# EAGLE schematic Laptimer (EAGLE 6.3)
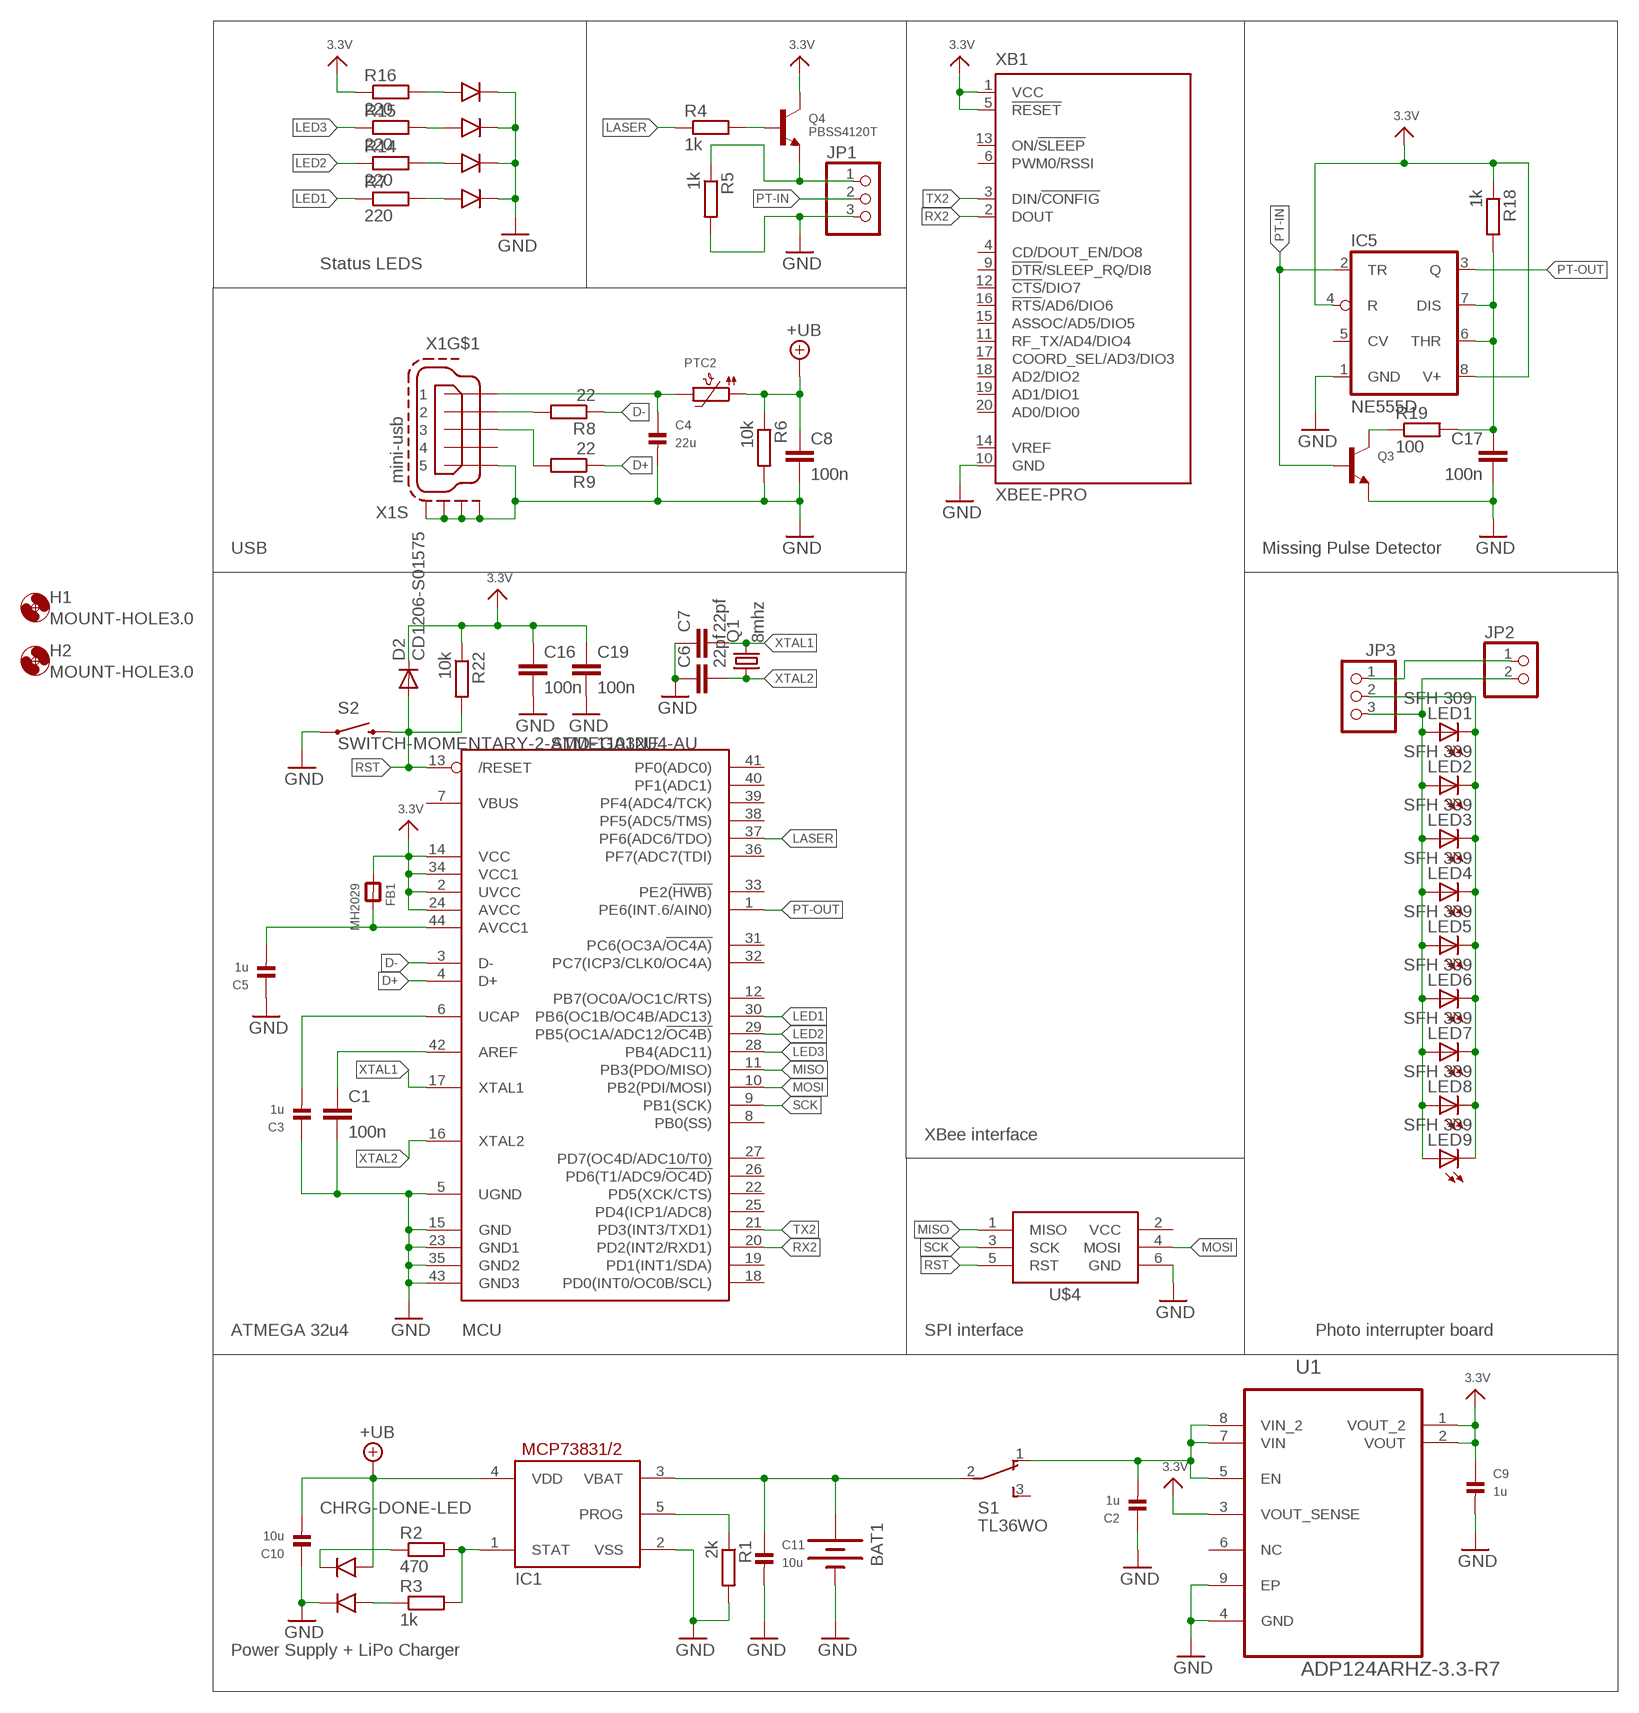
[diagram p0: schematic, sheet 1]

## Parts
BAT1  BATTERY18650  [BATTERY_18650-HOLDER]
C1  100n  C-EUC0603K  [C0603K]
C2  1u  CAP_CERAMIC_0805MP  [_0805MP]
C3  1u  CAP_CERAMIC_0805MP  [_0805MP]
C4  22u  CAP_CERAMIC_0805MP  [_0805MP]
C5  1u  CAP_CERAMIC_0805MP  [_0805MP]
C6  22pf  C-EUC0603K  [C0603K]
C7  22pf  C-EUC0603K  [C0603K]
C8  100n  C-EUC0603K  [C0603K]
C9  1u  CAP_CERAMIC_0805MP  [_0805MP]
C10  10u  CAP_CERAMIC_0805MP  [_0805MP]
C11  10u  CAP_CERAMIC_0805MP  [_0805MP]
C16  100n  C-EUC0603K  [C0603K]
C17  100n  C-EUC0603K  [C0603K]
C19  100n  C-EUC0603K  [C0603K]
D2  CD1206-S01575  DIODE-MINIMELF  [MINIMELF]
FB1  MH2029  FERRITE_0805MP  [_0805MP]
H1  MOUNT-HOLE3.0  [3,0]
H2  MOUNT-HOLE3.0  [3,0]
IC1  MCP73831/OT  [SOT23-5L]
IC5  NE555D  [SO08]
JP1  PINHD-1X3  [1X03]
JP2  HEADER-1X2ROUND  [1X02_ROUND]
JP3  PINHD-1X3  [1X03]
LED1  SFH 309  LED3MM  [LED3MM]
LED2  SFH 309  LED3MM  [LED3MM]
LED3  SFH 309  LED3MM  [LED3MM]
LED4  SFH 309  LED3MM  [LED3MM]
LED5  SFH 309  LED3MM  [LED3MM]
LED6  SFH 309  LED3MM  [LED3MM]
LED7  SFH 309  LED3MM  [LED3MM]
LED8  SFH 309  LED3MM  [LED3MM]
LED9  SFH 309  LED3MM  [LED3MM]
MCU  ATMEGA32U4-AU  [TQFP44]
PTC2  PTC1206  [1206]
Q1  8mhz  CRYSTALHC49S  [HC49/S]
Q3  TRANSISTOR_NPNWIDE  [SOT23-WIDE]
Q4  PBSS4120T  TRANSISTOR_NPNWIDE  [SOT23-WIDE]
R1  2k  R-EU_R0603  [R0603]
R2  470  R-EU_R0603  [R0603]
R3  1k  R-EU_R0603  [R0603]
R4  1k  R-EU_R0603  [R0603]
R5  1k  R-EU_R0603  [R0603]
R6  10k  R-EU_R0603  [R0603]
R7  220  R-EU_R0603  [R0603]
R8  22  R-EU_R0603  [R0603]
R9  22  R-EU_R0603  [R0603]
R14  220  R-EU_R0603  [R0603]
R15  220  R-EU_R0603  [R0603]
R16  220  R-EU_R0603  [R0603]
R18  1k  R-EU_R0603  [R0603]
R19  100  R-EU_R0603  [R0603]
R22  10k  R-EU_R0603  [R0603]
S1  TL36WO  [TL3XWO]
S2  SWITCH-MOMENTARY-2-SMD-1101NE  [TACTILE-SWITCH-1101NE]
U1  ADP124ARHZ-3.3-R7  [SOP65P490X110-9N]
U$1  BI-LEVEL-LED-INDICATOR  [BI-LEVEL-LED-INDICATOR]
U$4  AVRISP-BOX  [AVRISP-BOX]
U$18  BI-LEVEL-LED-INDICATOR  [BI-LEVEL-LED-INDICATOR]
U$19  BI-LEVEL-LED-INDICATOR  [BI-LEVEL-LED-INDICATOR]
X1  mini-usb  MINI-USB-SCHIELD-32005-301  [32005-301]
XB1  XBEE-PRO  [XBEE-PRO]

## Nets
3.3V: C9.1 C16.1 C19.1 D2.C FB1.1 IC5.4(R) IC5.8(V+) MCU.2(UVCC) MCU.14(VCC) MCU.24(AVCC) MCU.34(VCC1) Q4.3(C) R16.1 R18.1 R22.1 U1.1(VOUT_2) U1.2(VOUT) U1.3(VOUT_SENSE) XB1.1(VCC) XB1.5(!RESET)
+UB: C8.1 C10.2 IC1.4(VDD) PTC2.1 R6.1 U$1.ANODE1
CHRG-DONE-LED: R3.1 U$1.ANODE2
D+: MCU.4(D+) R9.1
D-: MCU.3(D-) R8.1
GND: BAT1.GND@1(-) C1.2 C2.1 C3.1 C4.2 C5.1 C6.1 C7.1 C8.2 C9.2 C10.1 C11.2 C16.2 C17.2 C19.2 IC1.2(VSS) IC5.1(GND) JP1.3 MCU.5(UGND) MCU.15(GND) MCU.23(GND1) MCU.35(GND2) MCU.43(GND3) Q3.2(E) R1.2 R5.2 R6.2 S2.P$1 U1.4(GND) U1.9(EP) U$1.CATHODE2 U$4.6(GND) U$18.CATHODE1 U$18.CATHODE2 U$19.CATHODE1 U$19.CATHODE2 X1.5 X1.M1(S:S1) X1.M2(S:S2) X1.M3(S:S3) X1.M4(S:S4) XB1.10(GND)
INT: JP3.2 LED1.K(C) LED2.K(C) LED3.K(C) LED4.K(C) LED5.K(C) LED6.K(C) LED7.K(C) LED8.K(C) LED9.K(C)
LASER: MCU.37(PF6(ADC6/TDO)) R4.1
LED1: MCU.30(PB6(OC1B/OC4B/ADC13)) R7.1
LED2: MCU.29(PB5(OC1A/ADC12/!OC4B)) R14.1
LED3: MCU.28(PB4(ADC11)) R15.1
MISO: MCU.11(PB3(PDO/MISO)) U$4.1(MISO)
MOSI: MCU.10(PB2(PDI/MOSI)) U$4.4(MOSI)
N$1: R9.2 X1.3
N$3: IC1.5(PROG) R1.1
N$4: IC1.1(STAT) R2.2 R3.2
N$5: JP1.1 Q4.2(E) R5.1
N$6: Q4.1(B) R4.2
N$7: C5.2 FB1.2 MCU.44(AVCC1)
N$9: C1.1 MCU.42(AREF)
N$10: JP2.1 JP3.1
N$12: C3.2 MCU.6(UCAP)
N$13: C4.1 PTC2.2 X1.1
N$14: R2.1 U$1.CATHODE1
N$15: R7.2 U$18.ANODE1
N$17: C2.2 S1.1(O) U1.5(EN) U1.7(VIN) U1.8(VIN_2)
N$21: R14.2 U$18.ANODE2
N$25: R15.2 U$19.ANODE1
N$27: R8.2 X1.2
N$31: BAT1.PWR@1(+) C11.1 IC1.3(VBAT) S1.2(P)
N$32: R16.2 U$19.ANODE2
N$36: C17.1 IC5.6(THR) IC5.7(DIS) R18.2 R19.2
N$40: JP2.2 JP3.3 LED1.A LED2.A LED3.A LED4.A LED5.A LED6.A LED7.A LED8.A LED9.A
N$41: Q3.3(C) R19.1
PT-IN: IC5.2(TR) JP1.2 Q3.1(B)
PT-OUT: IC5.3(Q) MCU.1(PE6(INT.6/AIN0))
RST: D2.A MCU.13(/RESET) R22.2 S2.P$2 U$4.5(RST)
RX2: MCU.20(PD2(INT2/RXD1)) XB1.2(DOUT)
SCK: MCU.9(PB1(SCK)) U$4.3(SCK)
TX2: MCU.21(PD3(INT3/TXD1)) XB1.3(DIN/!CONFIG)
XTAL1: C7.2 MCU.17(XTAL1) Q1.2
XTAL2: C6.2 MCU.16(XTAL2) Q1.1
Unconnected: IC5.5(CV) MCU.7(VBUS) MCU.8(PB0(SS)) MCU.12(PB7(OC0A/OC1C/RTS)) MCU.18(PD0(INT0/OC0B/SCL)) MCU.19(PD1(INT1/SDA)) MCU.22(PD5(XCK/CTS)) MCU.25(PD4(ICP1/ADC8)) MCU.26(PD6(T1/ADC9/!OC4D)) MCU.27(PD7(OC4D/ADC10/T0)) MCU.31(PC6(OC3A/!OC4A)) MCU.32(PC7(ICP3/CLK0/OC4A)) MCU.33(PE2(!HWB)) MCU.36(PF7(ADC7(TDI)) MCU.38(PF5(ADC5/TMS)) MCU.39(PF4(ADC4/TCK)) MCU.40(PF1(ADC1)) MCU.41(PF0(ADC0)) S1.3(S) U1.6(NC) X1.4 XB1.4(CD/DOUT_EN/DO8) XB1.6(PWM0/RSSI) XB1.9(!DTR!/SLEEP_RQ/DI8) XB1.11(RF_TX/AD4/DIO4) XB1.12(!CTS!/DIO7) XB1.13(ON/!SLEEP) XB1.14(VREF) XB1.15(ASSOC/AD5/DIO5) XB1.16(!RTS!/AD6/DIO6) XB1.17(COORD_SEL/AD3/DIO3) XB1.18(AD2/DIO2) XB1.19(AD1/DIO1) XB1.20(AD0/DIO0)

## Notes on the sheet
- Status LEDS
- USB | Missing Pulse Detector
- XBee interface
- ATMEGA 32u4 | SPI interface | Photo interrupter board
- Power Supply + LiPo Charger

## Power pins joined to a net without a drawn wire
VCC: U$4.2(VCC)

## Library data of the parts
BAT1 = SparkFun-Electromechanical:BATTERY: Battery Holders Various common sizes : AA, AAA, 18650 (PRT-12895), 20mm coin cell and 12mm coin cell. 20MM_4LEGS, BATT-10373
C1 C6-C8 C16 C17 C19 = rcl:C-EU: CAPACITOR, European symbol
C2-C5 C9-C11 = microbuilder:CAP_CERAMIC: Ceramic Capacitors 0402 - 0402 Surface Mount Capacitors 16pF 50V 5% [Digikey: 445-4899-2-ND] 18pF 50V 5% [Digikey: 490-1281-2-ND] 22pF 50V 5% [Digikey: 490-1283-2-ND] 68pF 50V 5% [Digikey: 490-1289-2-ND] 0.1uF 10V 10% [Digikey: 490-1318-2-ND] 1.0uF 6.3V 10% [Digikey: 490-1320-2-ND] 0603 - 0603 Surface Mount Capacitors 16 pF 50V 5% [Digikey: 445-5051-2-ND] 22 pF 50V [Digikey: PCC220ACVTR-ND] 33 pF 50V 5% [Digikey: 490-1415-1-ND] 56pF 50V 5% [Digikey: 490-1421-1-ND] 220pF 50V 5% [Digikey: 445-1285-1-ND] 680 pF 50V 2200 pF 50V 5% C0G [Digikey: 445-1297-1-ND] 5600 pF 100V 5% X7R [Digikey: 478-3711-1-ND] 0.1 µF 25V 10% [Digikey: PCC2277TR-ND] 0.22 µF 16V 10% X7R [Digikey: 445-1318-1-ND] 1.0 µF 25V 10% [Digikey: 445-5146-2-ND] 0603 - RF Specific 3pF 250V +/-0.1pF RF [Digikey: 712-1347-1-ND] 18 pF 250V 5% [Digikey: 478-3505-1-ND or 712-1322-1-ND] 56 pF 250V 5% C0G RF [Digikey: 490-4867-1-ND] 68 pF 250V RF [Digikey: 490-4868-1-ND] 0805 - 0805 Surface Mount Capacitors 220 pF 250V 2% RF Ceramic Capacitor [Digikey: 712-1398-1-ND] 1000 pF 50V 2% NP0 Ceramic Capacitor [Digikey: 478-3760-1-ND] 0.1 µF 25V 10% Ceramic Capacitor [Digikey: PCC1828TR-ND] 1.0 µF 16V 10% Ceramic Capacitor[Digikey: 490-1691-2-ND] 10.0 µF 10V 10% Ceramic Capacitor[Digikey: 709-1228-1-ND] 10.0 uF 16V 10% Ceramic Capacitor [Digikey: 478-5165-2-ND] 47 uF 6.3V 20% Ceramic Capacitor [Digikey: 587-1779-1-ND or 399-5506-1-ND] 1206 - 1206 Surface Mount Capacitors 47uF 10V 20% Ceramic Capacitor [Digikey: 490-5528-1-ND or 399-5508-1-ND or 445-6010-1-ND] 100uF 6.3V -20%, +80% Y5V Ceramic Capacitor (Digikey: 490-4512-1-ND, Mouser: 81-GRM31CF50J107ZE1L)
D2 = diode:DIODE-: DIODE
FB1 = microbuilder:FERRITE: Ferrite Bead 0603 MMZ1608B121C - 120 Ohm @ 100MHz, 600mA, 0.15 Ohm DC Resistance - Digikey: 445-2164-1-ND BK1608HW121-T - 120 Ohm, 600mA Ferrite Chip - Digikey: 587-1876-2-ND 0805 HZ0805B272R-10 - 2.7K Ohm @ 100MHz, 200mA, 0.8 Ohm DC Resistance - Digikey: 240-2504-1-ND (see also Murata BLM21BD272SN1L) MMZ2012Y152B - 1.5K Ohm @ 100MHz, 500mA, 0.4 Ohm DC Resistance - Digikey: 445-1560-1-ND - Mainly for high frequency (80-400MHz) MMZ2012R102A - 1K Ohm @ 100MHz, 500mA, 0.3 Ohm DC Resistance - Digikey: 445-1555-2-ND - More general purpose (10-200MHz)
H1 H2 = holes:MOUNT-HOLE: MOUNTING HOLE with drill center marker
IC1 = adafruit:MCP73831: MCP73831/2 Miniature Single-Cell, Fully Integrated Li-Ion, Li-Polymer Charge Management Controllers. Nice and small simple lipoly charge controller, with adjustable current and status output (LED) http://www.ladyada.net/library/pcb/eaglelibrary.html
IC5 = linear:*555: TIMER
JP1 JP3 = adafruit:PINHD-1X3: PIN HEADER
JP2 = microbuilder:HEADER-1X2: PIN HEADER
LED1-LED9 = adafruit:LED: LED OSRAM: - CHIPLED LG R971, LG N971, LY N971, LG Q971, LY Q971, LO R971, LY R971 LH N974, LH R974 LS Q976, LO Q976, LY Q976 LO Q996 - Hyper CHIPLED LW Q18S LB Q993, LB Q99A, LB R99A - SideLED LS A670, LO A670, LY A670, LG A670, LP A670 LB A673, LV A673, LT A673, LW A673 LH A674 LY A675 LS A676, LA A676, LO A676, LY A676, LW A676 LS A679, LY A679, LG A679 - Hyper Micro SIDELED® LS Y876, LA Y876, LO Y876, LY Y876 LT Y87S - SmartLED LW L88C, LW L88S LB L89C, LB L89S, LG L890 LS L89K, LO L89K, LY L89K LS L896, LA L896, LO L896, LY L896 - TOPLED LS T670, LO T670, LY T670, LG T670, LP T670 LSG T670, LSP T670, LSY T670, LOP T670, LYG T670 LG T671, LOG T671, LSG T671 LB T673, LV T673, LT T673, LW T673 LH T674 LS T676, LA T676, LO T676, LY T676, LB T676, LH T676, LSB T676, LW T676 LB T67C, LV T67C, LT T67C, LS T67K, LO T67K, LY T67K, LW E67C LS E67B, LA E67B, LO E67B, LY E67B, LB E67C, LV E67C, LT E67C LW T67C LS T679, LY T679, LG T679 LS T770, LO T770, LY T770, LG T770, LP T770 LB T773, LV T773, LT T773, LW T773 LH T774 LS E675, LA E675, LY E675, LS T675 LS T776, LA T776, LO T776, LY T776, LB T776 LHGB T686 LT T68C, LB T68C - Hyper Mini TOPLED® LB M676 - Mini TOPLED Santana® LG M470 LS M47K, LO M47K, LY M47K Source: http://www.osram.convergy.de/
MCU = adafruit:ATMEGA32U4: http://www.ladyada.net/library/eagle
PTC2 = microbuilder:PTC: PTC (Resettable Fuse) 1206 Package 250mA PTC (16V Max, Time-to-Trip: 0.08s) - Digikey: F2110CT-ND 1210 Package 100mA PTC (30V Max, Time-to-Trip: 0.6s) - Digikey: MF-USMF010-2CT-ND 1812 Package 750mA PTC (24V Max, Time-to-Trip: 0.2s) - Digikey: MF-MSMF075/24-2CT-ND
Q1 = adafruit:CRYSTAL: CRYSTAL; OC_FARNELL: 1667008; OC_NEWARK: unknown
Q3 Q4 = microbuilder:TRANSISTOR_NPN: NPN Transistor Transistor (NPN) 500mA 45V - BC817 [Digikey: 568-1631-1-ND] Transistor (NPN) 500mA 45V - BC817,215 [Mouser: 771-BC817-T/R] SOT23-R - SOT23 footprint optimised for use with solder paste and reflow ovens. SOT23-W - SOT23 footprint optimised for hand-soldering (larger pads).
R1-R9 R14-R16 R18 R19 R22 = rcl:R-EU_: RESISTOR, European symbol
S1 = switch:TL36WO: TINY SWITCH ON - ON Source: http://www2.produktinfo.conrad.com/datenblaetter/700000-724999/705152-da-01-de-Subminiaturschalter_TL_36WO.pdf
S2 = SparkFun-Electromechanical:SWITCH-MOMENTARY-2: Various NO switches- pushbuttons, reed, etc
U1 = Analog Devices_By_element14_Batch_1:ADP124ARHZ-3.3-R7: 5.5 V Input, 500 mA, Low Quiescent Current, CMOS Linear Regulators; MPN: ADP124ARHZ-3.3-R7; OC_FARNELL: 1827296; OC_NEWARK: 63R9752; PACKAGE: SOIC-8; SUPPLIER: Analog Devices
U$1 U$18 U$19 = unicorn_v2:BI-LEVEL-LED-INDICATOR
U$4 = adafruit:AVRISP: AVR ISP HEADER Standard 6 pin header for AVR programming
X1 = con-cypressindustries:MINI-USB-SCHIELD-: MINI USB-B Conector Source: www.cypressindustries.com; OC_FARNELL: unknown; OC_NEWARK: unknown
XB1 = microbuilder:XBEE: XBee (TM) /XBee-PRO(TM) OEM RF Modules Source: MaxStream, Inc. xbee_productmanual.pdf